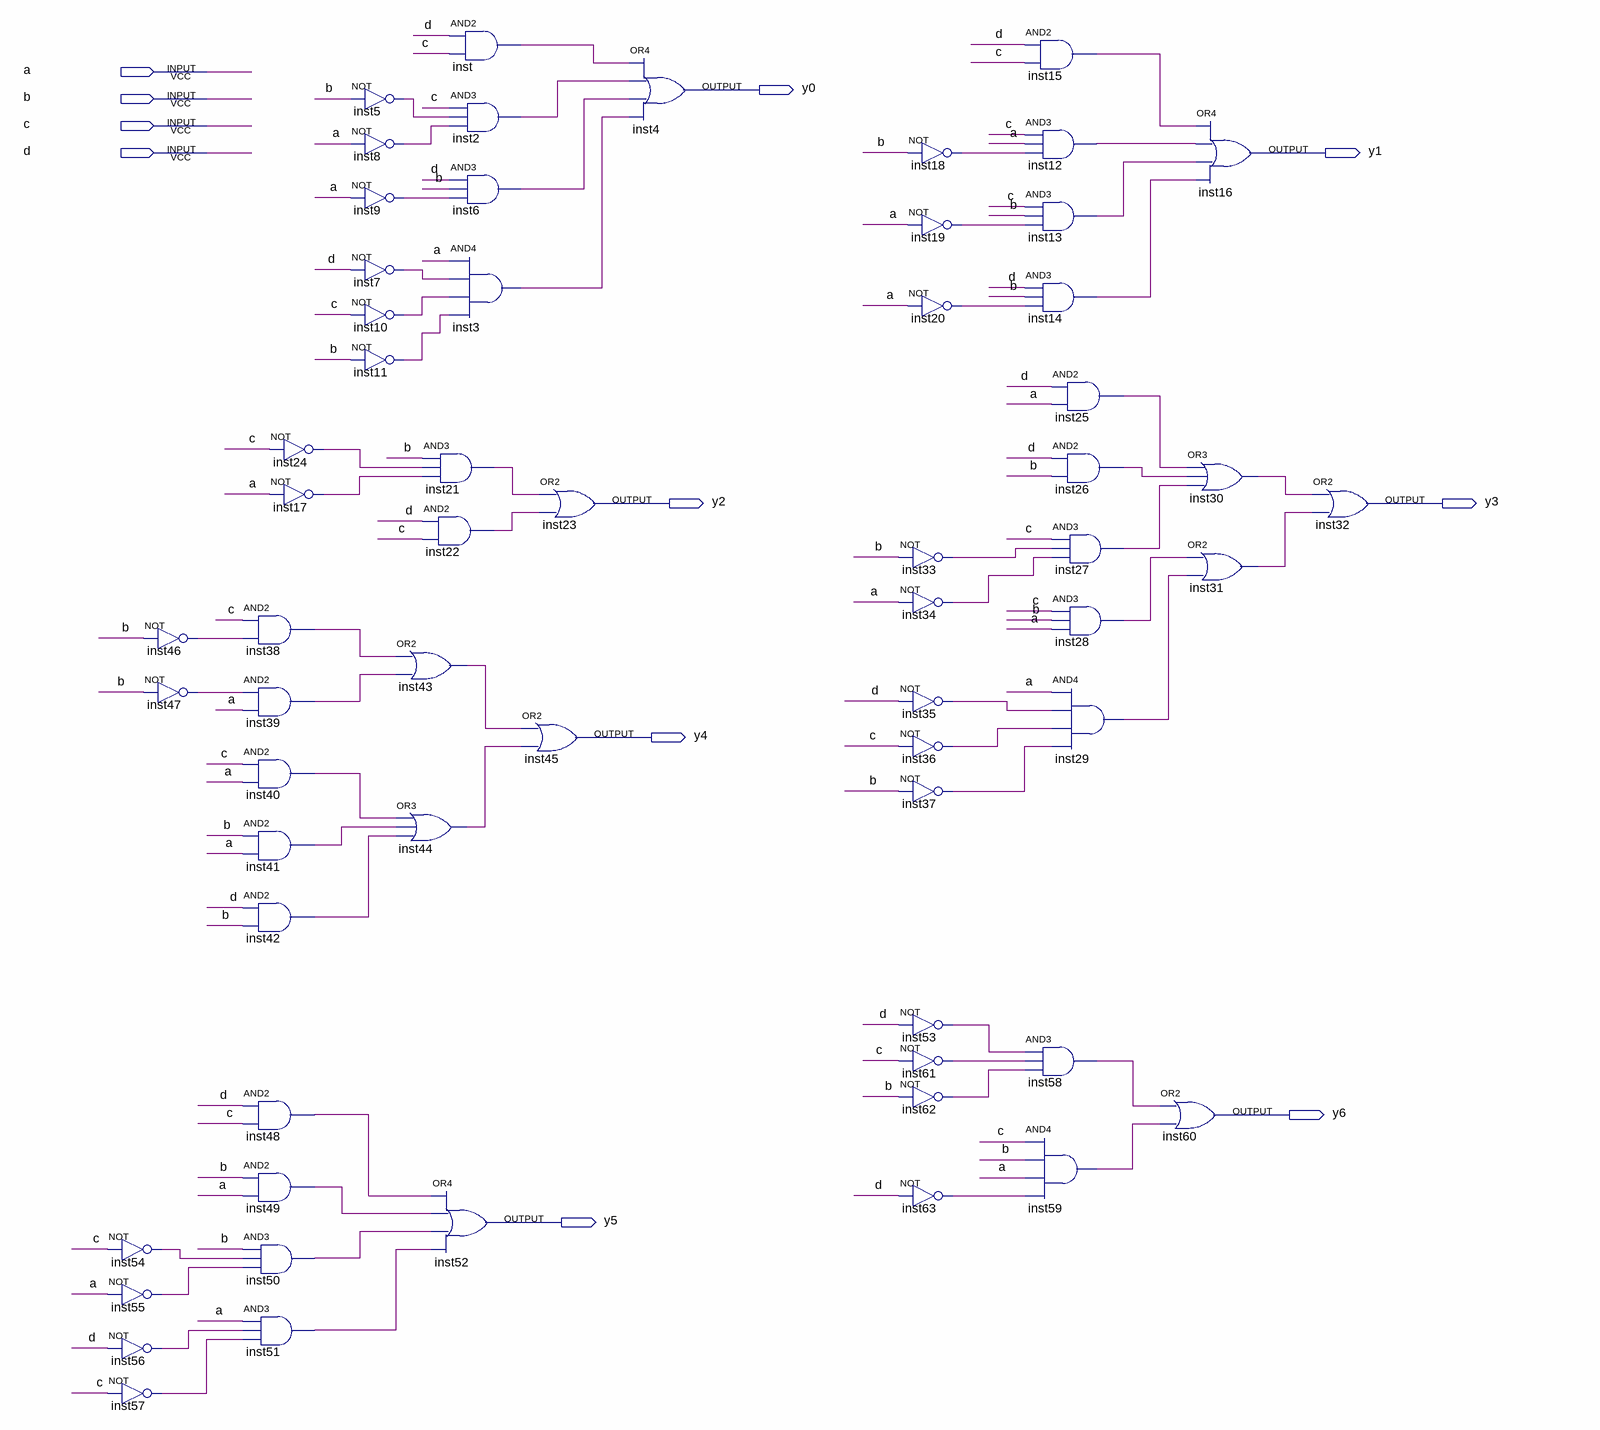
[diagram p0: schematic sheet]
// Quartus schematic BCDto7_seg.bdf as structural Verilog: 63 symbols, 11 pins
module BCDto7_seg (
  input  a,
  input  b,
  input  c,
  input  d,
  output y0,
  output y1,
  output y2,
  output y3,
  output y4,
  output y6,
  output y5
);

  wire inst2_out, inst3_out, inst5_out, inst6_out, inst7_out, inst8_out, inst9_out, inst10_out, inst11_out,
       inst12_out, inst13_out, inst14_out, inst15_out, inst17_out, inst18_out, inst19_out, inst20_out,
       inst21_out, inst22_out, inst24_out, inst25_out, inst26_out, inst27_out, inst28_out, inst29_out,
       inst30_out, inst31_out, inst33_out, inst34_out, inst35_out, inst36_out, inst37_out, inst38_out,
       inst39_out, inst40_out, inst41_out, inst42_out, inst43_out, inst44_out, inst46_out, inst47_out,
       inst48_out, inst49_out, inst50_out, inst51_out, inst53_out, inst54_out, inst55_out, inst56_out,
       inst57_out, inst58_out, inst59_out, inst61_out, inst62_out, inst63_out, inst_out;

  not inst46 (inst46_out, b);
  not inst47 (inst47_out, b);
  not inst54 (inst54_out, c);
  not inst55 (inst55_out, a);
  not inst56 (inst56_out, d);
  not inst57 (inst57_out, c);
  and inst38 (inst38_out, c, inst46_out);
  and inst39 (inst39_out, inst47_out, a);
  and inst40 (inst40_out, c, a);
  and inst41 (inst41_out, b, a);
  and inst42 (inst42_out, d, b);
  and inst48 (inst48_out, d, c);
  and inst49 (inst49_out, b, a);
  and inst50 (inst50_out, b, inst54_out, inst55_out);
  and inst51 (inst51_out, a, inst56_out, inst57_out);
  not inst24 (inst24_out, c);
  not inst17 (inst17_out, a);
  not inst5 (inst5_out, b);
  not inst8 (inst8_out, a);
  not inst9 (inst9_out, a);
  not inst7 (inst7_out, d);
  not inst10 (inst10_out, c);
  not inst11 (inst11_out, b);
  and inst (inst_out, d, c);
  and inst2 (inst2_out, c, inst5_out, inst8_out);
  and inst6 (inst6_out, d, b, inst9_out);
  and inst3 (inst3_out, a, inst7_out, inst10_out, inst11_out);
  and inst21 (inst21_out, b, inst24_out, inst17_out);
  and inst22 (inst22_out, d, c);
  or inst43 (inst43_out, inst38_out, inst39_out);
  or inst44 (inst44_out, inst40_out, inst41_out, inst42_out);
  or inst52 (y5, inst48_out, inst49_out, inst50_out, inst51_out);
  or inst45 (y4, inst43_out, inst44_out);
  or inst23 (y2, inst21_out, inst22_out);
  or inst4 (y0, inst_out, inst2_out, inst6_out, inst3_out);
  not inst18 (inst18_out, b);
  not inst19 (inst19_out, a);
  not inst20 (inst20_out, a);
  not inst33 (inst33_out, b);
  not inst34 (inst34_out, a);
  not inst35 (inst35_out, d);
  not inst36 (inst36_out, c);
  not inst37 (inst37_out, b);
  not inst53 (inst53_out, d);
  not inst61 (inst61_out, c);
  not inst62 (inst62_out, b);
  not inst63 (inst63_out, d);
  and inst15 (inst15_out, d, c);
  and inst12 (inst12_out, c, a, inst18_out);
  and inst13 (inst13_out, c, b, inst19_out);
  and inst14 (inst14_out, d, b, inst20_out);
  and inst58 (inst58_out, inst53_out, inst61_out, inst62_out);
  and inst59 (inst59_out, c, b, a, inst63_out);
  and inst25 (inst25_out, d, a);
  and inst26 (inst26_out, d, b);
  and inst27 (inst27_out, c, inst33_out, inst34_out);
  and inst28 (inst28_out, c, b, a);
  and inst29 (inst29_out, a, inst35_out, inst36_out, inst37_out);
  or inst60 (y6, inst58_out, inst59_out);
  or inst16 (y1, inst15_out, inst12_out, inst13_out, inst14_out);
  or inst30 (inst30_out, inst25_out, inst26_out, inst27_out);
  or inst31 (inst31_out, inst28_out, inst29_out);
  or inst32 (y3, inst30_out, inst31_out);
endmodule
